# EAGLE schematic lightswitchx2 (EAGLE 7.6.0)
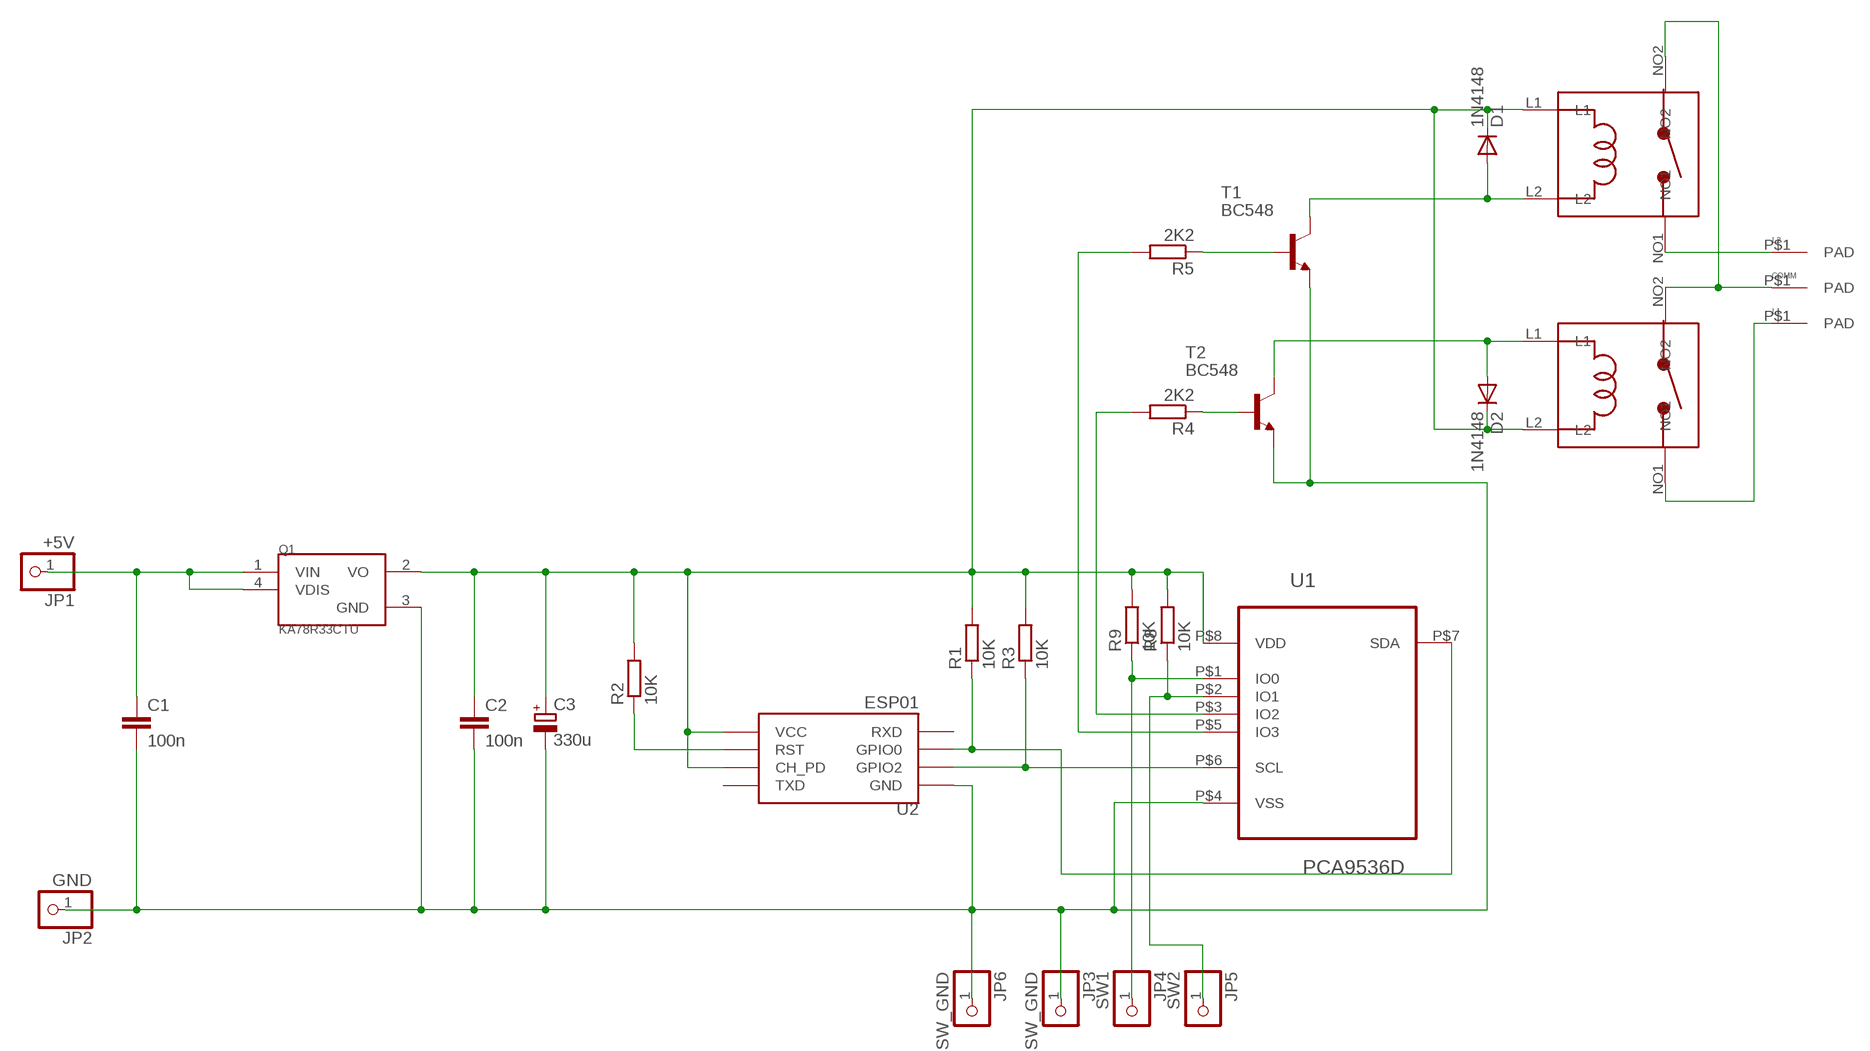
[diagram p0: schematic, sheet 1]

## Parts
C1  100n  C-EU050-024X044  [C050-024X044]
C2  100n  C-EU050-024X044  [C050-024X044]
C3  330u  CPOL-EUE2-5  [E2-5]
COMM  PAD  [PAD]
D1  1N4148  1N4148DO35-7  [DO35-7]
D2  1N4148  1N4148DO35-7  [DO35-7]
JP1  +5V  PINHD-1X1  [1X01]
JP2  GND  PINHD-1X1  [1X01]
JP3  SW_GND  PINHD-1X1CB  [1X01-CLEANBIG]
JP4  SW1  PINHD-1X1CB  [1X01-CLEANBIG]
JP5  SW2  PINHD-1X1CB  [1X01-CLEANBIG]
JP6  SW_GND  PINHD-1X1CB  [1X01-CLEANBIG]
L1  L1  PAD  [PAD]
L2  X  PAD  [PAD]
Q1  KA78R33CTU  [TO-220-4]
R1  10K  R-EU_0207/10  [0207/10]
R2  10K  R-EU_0204/7  [0204/7]
R3  10K  R-EU_0204/7  [0204/7]
R4  2K2  R-EU_0204/7  [0204/7]
R5  2K2  R-EU_0204/7  [0204/7]
R8  10K  R-EU_0207/7  [0207/7]
R9  10K  R-EU_0207/10  [0207/10]
REL1  LEG1A-5  [LEG-1A-5]
REL2  LEG1A-5  [LEG-1A-5]
T1  BC548  [TO92-EBC]
T2  BC548  [TO92-EBC]
U1  PCA9536D  PCA9536D,118ADAPTER  [ADAPTER]
U2  ESP01  [ESP01]

## Nets
N$1: C1.1 JP1.1 Q1.1(VIN) Q1.4(VDIS)
N$2: R5.2 U1.P$5(IO3)
N$3: L1.P$1(PAD) REL1.NO1
N$4: R1.1 U1.P$7(SDA) U2.GPIO0
N$5: COMM.P$1(PAD) REL1.NO2 REL2.NO2
N$6: R3.1 U1.P$6(SCL) U2.GPIO2
N$7: R2.1 U2.RST
N$8: R5.1 T1.B
N$9: R4.2 U1.P$3(IO2)
N$10: R4.1 T2.B
N$11: JP4.1 R9.1 U1.P$1(IO0)
N$12: L2.P$1(PAD) REL2.NO1
N$13: D1.A REL2.L2 T1.C
N$14: JP5.1 R8.1 U1.P$2(IO1)
N$15: D2.A REL1.L1 T2.C
VDD: C2.1 C3.+ D1.C D2.C Q1.2(VO) R1.2 R2.2 R3.2 R8.2 R9.2 REL1.L2 REL2.L1 U1.P$8(VDD) U2.CH_PD U2.VCC
VSS: C1.2 C2.2 C3.- JP2.1 JP3.1 JP6.1 Q1.3(GND) T1.E T2.E U1.P$4(VSS) U2.GND
Unconnected: U2.RX(RXD) U2.TX(TXD)

## Library data of the parts
C1 C2 = rcl:C-EU: CAPACITOR, European symbol
C3 = rcl:CPOL-EU: POLARIZED CAPACITOR, European symbol
COMM L1 L2 = LEG-1A-5:PAD
D1 D2 = diode:1N4148: DIODE high speed (Philips)
JP1-JP6 = adafruit:PINHD-1X1: Pin header 1x1 for 0.1" spacing With round pins
Q1 = KA78R33CTU:KA78R33CTU: KA78R Series 3.3 V Fixed Output 1 A LDO Voltage Regulator - TO-220F-4L; AVAILABILITY: Good; DESCRIPTION: KA78R Series 3.3 V Fixed Output 1 A LDO Voltage Regulator - TO-220F-4L; MF: Fairchild Semiconductor; MP: KA78R33CTU; PACKAGE: TO-220 Fairchild Semiconductor; PRICE: 0.55 USD
R1-R5 R8 R9 = rcl:R-EU_: RESISTOR, European symbol
REL1 REL2 = LEG-1A-5:LEG1A-5
T1 T2 = transistor-npn:BC548*: NPN Transistor
U1 = PCA9536D:PCA9536D,118: 4-bit I2C-bus and SMBus I/O port
U2 = esp8266modules:ESP01: ESP8266 Wifi module 01